# EAGLE design Teensylu (EAGLE 6.5.0)
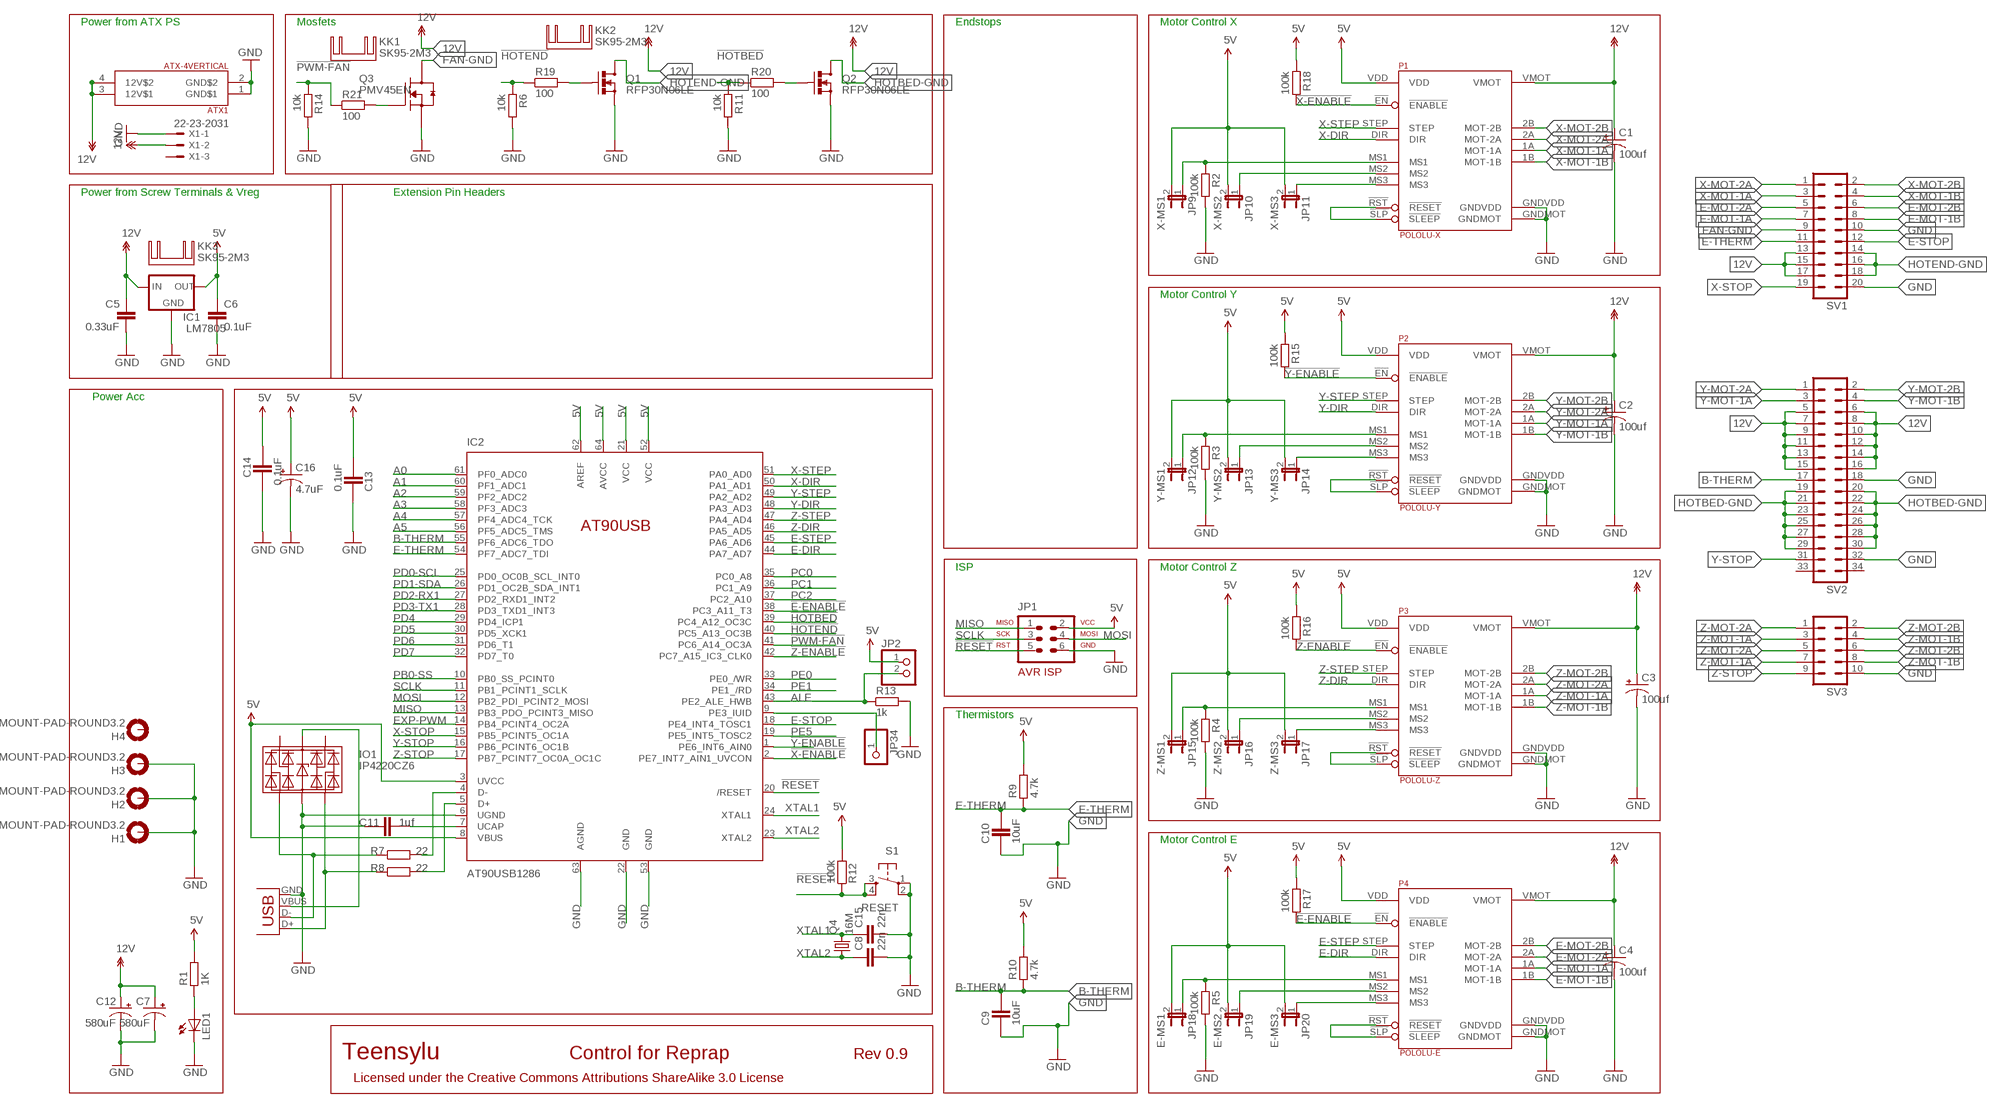
[diagram p0: schematic, sheet 1]

## Parts
ATX1  ATX-4VERTICAL  [MINIFITJR-4-VERTICAL]
C1  100uf  CAP_POLPTH1  [CPOL-RADIAL-100UF-25V]
C2  100uf  CAP_POLPTH1  [CPOL-RADIAL-100UF-25V]
C3  100uf  CAP_POLPTH1  [CPOL-RADIAL-100UF-25V]
C4  100uf  CAP_POLPTH1  [CPOL-RADIAL-100UF-25V]
C5  0.33uF  CAPPTH2  [CAP-PTH-SMALL2]
C6  0.1uF  CAPPTH2  [CAP-PTH-SMALL2]
C7  580uF  CAP_POLPTH4  [CPOL-RADIAL-1000UF-25V]
C8  22n  C-EUC0603  [C0603]
C9  10uF  CAPACITOR_0603  [CAPC1608X92N]
C10  10uF  CAPACITOR_0603  [CAPC1608X92N]
C11  1uf  CAPACITOR_0603  [CAPC1608X92N]
C12  580uF  CAP_POLPTH4  [CPOL-RADIAL-1000UF-25V]
C13  0.1uF  CAPACITOR_0603  [CAPC1608X92N]
C14  0.1uF  CAPACITOR_0603  [CAPC1608X92N]
C15  22n  C-EUC0603  [C0603]
C16  4.7uF  CAP_POLPTH2  [CPOL-RADIAL-10UF-25V]
H1  MOUNT-PAD-ROUND3.2  [3,2-PAD]
H2  MOUNT-PAD-ROUND3.2  [3,2-PAD]
H3  MOUNT-PAD-ROUND3.2  [3,2-PAD]
H4  MOUNT-PAD-ROUND3.2  [3,2-PAD]
IC1  LM7805  V_REG_78XX  [78XXL-CUSTOM]
IC2  AT90USB1286  AT90USB  [TQFP64-2]
IO1  IP4220CZ6  [SOT23-6]
J1  USB  USBPTH  [USB-B-PTH]
JP1  AVR-ISP-6VERT  [AVR-ISP-6]
JP2  PINHD-1X2  [1X02]
JP9  X-MS1  JUMPER-2PTH  [1X02]
JP10  X-MS2  JUMPER-2PTH  [1X02]
JP11  X-MS3  JUMPER-2PTH  [1X02]
JP12  Y-MS1  JUMPER-2PTH  [1X02]
JP13  Y-MS2  JUMPER-2PTH  [1X02]
JP14  Y-MS3  JUMPER-2PTH  [1X02]
JP15  Z-MS1  JUMPER-2PTH  [1X02]
JP16  Z-MS2  JUMPER-2PTH  [1X02]
JP17  Z-MS3  JUMPER-2PTH  [1X02]
JP18  E-MS1  JUMPER-2PTH  [1X02]
JP19  E-MS2  JUMPER-2PTH  [1X02]
JP20  E-MS3  JUMPER-2PTH  [1X02]
JP34  PINHD-1X1  [1X01]
KK1  SK95-2M3  [SK95-2M3]
KK2  SK95-2M3  [SK95-2M3]
KK3  SK95-2M3  [SK95-2M3]
LED1  LED5MM  [LED5MM]
P1  POLOLU-X  POLOLU-ALLEGRO  [POLOLU-ALLEGRO-PTH]
P2  POLOLU-Y  POLOLU-ALLEGRO  [POLOLU-ALLEGRO-PTH]
P3  POLOLU-Z  POLOLU-ALLEGRO  [POLOLU-ALLEGRO-PTH]
P4  POLOLU-E  POLOLU-ALLEGRO  [POLOLU-ALLEGRO-PTH]
Q1  RFP30N06LE  MOSFET-NCHANNELPTH2  [TO220V]
Q2  RFP30N06LE  MOSFET-NCHANNELPTH2  [TO220V]
Q3  PMV45EN  MOSFET-NCH_SOT-23  [SOT95P280X135-3N]
Q4  16M  CRYSTALHC49U-V  [HC49U-V]
R1  1K  RESISTOR_0603  [RESC1608X55N]
R2  100k  RESISTOR_0603  [RESC1608X55N]
R3  100k  RESISTOR_0603  [RESC1608X55N]
R4  100k  RESISTOR_0603  [RESC1608X55N]
R5  100k  RESISTOR_0603  [RESC1608X55N]
R6  10k  RESISTOR_0603  [RESC1608X55N]
R7  22  RESISTOR_0603  [RESC1608X55N]
R8  22  RESISTOR_0603  [RESC1608X55N]
R9  4.7k  RESISTOR_0603  [RESC1608X55N]
R10  4.7k  RESISTOR_0603  [RESC1608X55N]
R11  10k  RESISTOR_0603  [RESC1608X55N]
R12  100k  RESISTOR_0603  [RESC1608X55N]
R13  1k  RESISTOR_0603  [RESC1608X55N]
R14  10k  RESISTOR_0603  [RESC1608X55N]
R15  100k  RESISTOR_0603  [RESC1608X55N]
R16  100k  RESISTOR_0603  [RESC1608X55N]
R17  100k  RESISTOR_0603  [RESC1608X55N]
R18  100k  RESISTOR_0603  [RESC1608X55N]
R19  100  RESISTOR_0603  [RESC1608X55N]
R20  100  RESISTOR_0603  [RESC1608X55N]
R21  100  RESISTOR_0603  [RESC1608X55N]
S1  RESET  TAC_SWITCHPTH  [TACTILE-PTH]
SV1  ML20L  [ML20L]
SV2  ML34L  [ML34L]
SV3  ML10L  [ML10L]
X1  22-23-2031  [22-23-2031]

## Nets
5V: C6.1 C13.2 C14.1 C16.1(+) IC1.OUT IC2.3(UVCC) IC2.8(VBUS) IC2.21(VCC) IC2.52(VCC) IC2.62(AREF) IC2.64(AVCC) JP1.2 JP2.1 JP9.2 JP10.2 JP11.2 JP12.2 JP13.2 JP14.2 JP15.2 JP16.2 JP17.2 JP18.2 JP19.2 JP20.2 P1.VDD P2.VDD P3.VDD P4.VDD R1.2 R9.2 R10.2 R12.2 R15.1 R16.1 R17.1 R18.1
12V: ATX1.3(12V$1) ATX1.4(12V$2) C1.1(+) C2.1(+) C3.1(+) C4.1(+) C5.1 C7.1(+) C12.1(+) IC1.IN P1.VMOT P2.VMOT P3.VMOT P4.VMOT SV1.13 SV1.15 SV1.17 SV2.5 SV2.6 SV2.7 SV2.8 SV2.9 SV2.10 SV2.11 SV2.12 SV2.13 SV2.14 SV2.15 SV2.16 X1.2
!E-ENABLE: IC2.38(PC3_A11_T3) P4.!EN(!ENABLE) R17.2
!HOTBED: IC2.39(PC4_A12_OC3C) R11.1 R20.1
!HOTEND: IC2.40(PC5_A13_OC3B) R6.1 R19.1
!PWM-FAN: IC2.41(PC6_A14_OC3A) R14.1 R21.1
!RESET: IC2.20(/RESET) JP1.5 R12.1 S1.3 S1.4
!X-ENABLE: IC2.2(PE7_INT7_AIN1_UVCON) P1.!EN(!ENABLE) R18.2
!Y-ENABLE: IC2.1(PE6_INT6_AIN0) P2.!EN(!ENABLE) R15.2
!Z-ENABLE: IC2.42(PC7_A15_IC3_CLK0) P3.!EN(!ENABLE) R16.2
A0: IC2.61(PF0_ADC0)
A1: IC2.60(PF1_ADC1)
A2: IC2.59(PF2_ADC2)
A3: IC2.58(PF3_ADC3)
A4: IC2.57(PF4_ADC4_TCK)
A5: IC2.56(PF5_ADC5_TMS)
ALE: IC2.43(PE2_ALE_HWB) JP2.2 R13.1
B-THERM: C9.2 IC2.55(PF6_ADC6_TDO) R10.1 SV2.17
E-DIR: IC2.44(PA7_AD7) P4.DIR
E-MOT-1A [power]: P4.1A(MOT-1A) SV1.7
E-MOT-1B [power]: P4.1B(MOT-1B) SV1.8
E-MOT-2A [power]: P4.2A(MOT-2A) SV1.5
E-MOT-2B [power]: P4.2B(MOT-2B) SV1.6
E-MS1: JP18.1 P4.MS1 R5.1
E-MS2: JP19.1 P4.MS2
E-MS3: JP20.1 P4.MS3
E-RESETSLEEP: P4.!RST(!RESET) P4.!SLP(!SLEEP)
E-STEP: IC2.45(PA6_AD6) P4.STEP
E-STOP: IC2.18(PE4_INT4_TOSC1) SV1.12
E-THERM: C10.2 IC2.54(PF7_ADC7_TDI) R9.1 SV1.11
EXP-PWM: IC2.14(PB4_PCINT4_OC2A)
FAN-GND: Q3.3(D) SV1.9
GND [power]: ATX1.1(GND$1) ATX1.2(GND$2) C1.2(-) C2.2(-) C3.2(-) C4.2(-) C5.2 C6.2 C7.2(-) C8.2 C9.1 C10.1 C11.1 C12.2(-) C13.1 C14.2 C15.2 C16.2(-) H1.B3,2(MOUNT) H2.B3,2(MOUNT) H3.B3,2(MOUNT) IC1.GND IC2.6(UGND) IC2.22(GND) IC2.53(GND) IC2.63(AGND) IO1.2(GND) J1.GND JP1.6 LED1.K(C) P1.GNDMOT P1.GNDVDD P2.GNDMOT P2.GNDVDD P3.GNDMOT P3.GNDVDD P4.GNDMOT P4.GNDVDD Q1.3(S) Q2.3(S) Q3.2(S) R2.2 R3.2 R4.2 R5.2 R6.2 R11.2 R13.2 R14.2 S1.1 S1.2 SV1.10 SV1.20 SV2.18 SV2.32 SV3.10 X1.1
HOTBED-GND [power]: Q2.2(D) SV2.19 SV2.20 SV2.21 SV2.22 SV2.23 SV2.24 SV2.25 SV2.26 SV2.27 SV2.28 SV2.29 SV2.30
HOTEND-GND [power]: Q1.2(D) SV1.14 SV1.16 SV1.18
MISO: IC2.13(PB3_PDO_PCINT3_MISO) JP1.1
MOSI: IC2.12(PB2_PDI_PCINT2_MOSI) JP1.4
N$1: LED1.A R1.1
N$2: IO1.4(C) J1.D- R7.1
N$3: IC2.4(D-) R7.2
N$4: IC2.5(D+) R8.2
N$5: IO1.6(D) J1.D+ R8.1
N$6: IO1.5(UCC) J1.VBUS
N$7: IC2.9(PE3_IUID) JP34.1
N$9: C11.2 IC2.7(UCAP)
N$10: Q3.1(G) R21.2
N$11: Q1.1(G) R19.2
N$12: Q2.1(G) R20.2
PB0-SS: IC2.10(PB0_SS_PCINT0)
PC0: IC2.35(PC0_A8)
PC1: IC2.36(PC1_A9)
PC2: IC2.37(PC2_A10)
PD0-SCL: IC2.25(PD0_OC0B_SCL_INT0)
PD1-SDA: IC2.26(PD1_OC2B_SDA_INT1)
PD2-RX1: IC2.27(PD2_RXD1_INT2)
PD3-TX1: IC2.28(PD3_TXD1_INT3)
PD4: IC2.29(PD4_ICP1)
PD5: IC2.30(PD5_XCK1)
PD6: IC2.31(PD6_T1)
PD7: IC2.32(PD7_T0)
PE0: IC2.33(PE0_/WR)
PE1: IC2.34(PE1_/RD)
PE5: IC2.19(PE5_INT5_TOSC2)
SCLK: IC2.11(PB1_PCINT1_SCLK) JP1.3
X-DIR: IC2.50(PA1_AD1) P1.DIR
X-MOT-1A [power]: P1.1A(MOT-1A) SV1.3
X-MOT-1B [power]: P1.1B(MOT-1B) SV1.4
X-MOT-2A [power]: P1.2A(MOT-2A) SV1.1
X-MOT-2B [power]: P1.2B(MOT-2B) SV1.2
X-MS1: JP9.1 P1.MS1 R2.1
X-MS2: JP10.1 P1.MS2
X-MS3: JP11.1 P1.MS3
X-RESETSLEEP: P1.!RST(!RESET) P1.!SLP(!SLEEP)
X-STEP: IC2.51(PA0_AD0) P1.STEP
X-STOP: IC2.15(PB5_PCINT5_OC1A) SV1.19
XTAL1: C15.1 IC2.24(XTAL1) Q4.2
XTAL2: C8.1 IC2.23(XTAL2) Q4.1
Y-DIR: IC2.48(PA3_AD3) P2.DIR
Y-MOT-1A [power]: P2.1A(MOT-1A) SV2.3
Y-MOT-1B [power]: P2.1B(MOT-1B) SV2.4
Y-MOT-2A [power]: P2.2A(MOT-2A) SV2.1
Y-MOT-2B [power]: P2.2B(MOT-2B) SV2.2
Y-MS1: JP12.1 P2.MS1 R3.1
Y-MS2: JP13.1 P2.MS2
Y-MS3: JP14.1 P2.MS3
Y-RESETSLEEP: P2.!RST(!RESET) P2.!SLP(!SLEEP)
Y-STEP: IC2.49(PA2_AD2) P2.STEP
Y-STOP: IC2.16(PB6_PCINT6_OC1B) SV2.31
Z-DIR: IC2.46(PA5_AD5) P3.DIR
Z-MOT-1A [power]: P3.1A(MOT-1A) SV3.3 SV3.7
Z-MOT-1B [power]: P3.1B(MOT-1B) SV3.4 SV3.8
Z-MOT-2A [power]: P3.2A(MOT-2A) SV3.1 SV3.5
Z-MOT-2B [power]: P3.2B(MOT-2B) SV3.2 SV3.6
Z-MS1: JP15.1 P3.MS1 R4.1
Z-MS2: JP16.1 P3.MS2
Z-MS3: JP17.1 P3.MS3
Z-RESETSLEEP: P3.!RST(!RESET) P3.!SLP(!SLEEP)
Z-STEP: IC2.47(PA4_AD4) P3.STEP
Z-STOP: IC2.17(PB7_PCINT7_OC0A_OC1C) SV3.9
Unconnected: H4.B3,2(MOUNT) IO1.1(A) IO1.3(B) SV2.33 SV2.34 X1.3

## Notes on the sheet
- Power from ATX PS | Mosfets | Endstops | Motor Control X
- Power from Screw Terminals & Vreg | Extension Pin Headers
- Motor Control Y
- Power Acc
- ISP | Motor Control Z
- Thermistors
- Motor Control E
- Teensylu | Control for Reprap | Rev 0.9
- Licensed under the Creative Commons Attributions ShareAlike 3.0 License

## Library data of the parts
ATX1 = atx-power-supply:ATX-4
C1-C4 C7 C12 C16 = SparkFun:CAP_POL: Capacitor Polarized These are standard SMD and PTH capacitors. Normally 10uF, 47uF, and 100uF in electrolytic and tantalum varieties. Always verify the external diameter of the through hole cap, it varies with capacity, voltage, and manufacturer. The EIA devices should be standard.
C5 C6 = SparkFun:CAP: Capacitor Standard 0603 ceramic capacitor, and 0.1" leaded capacitor.
C8 C15 = resistor:C-EU: CAPACITOR, European symbol
C9-C11 C13 C14 = ipc-7351-capacitor:CAPACITOR_
H1-H4 = holes:MOUNT-PAD-ROUND: MOUNTING PAD, round
IC1 = SparkFun:V_REG_78XX: Voltage Regulator Standard 7805 5V regulator. IGO (Input Ground Output). Spark Fun Electronics SKU : COM-00107
IC2 = Atmel-at90usb-teensy:AT90USB
IO1 = protection:IP4220CZ6: IP4220CZ6 Dual USB 2.0 Integrated ESD protection to IEC 61000-4-2 level 4 FEATURES > ESD IEC 61000-4-2 level 4, ± 8kV contact discharge compliant protection > Four ultra-low input capacitance (1 pF typ.) ESD rail-to-rail protection diodes > Low voltage clamping due to integrated Zener diode > Small 6 lead SO6 (SOT457) package APPLICATIONS General-purpose downstream ESD protection high frequency analog signals and high-speed serial data transmission for ports inside: > Cellular and PCS mobile handsets > PC-/Notebook USB2.0/IEEE1394 ports > DVI interfaces > Cordless telephones > Wireless data (WAN/LAN) systems > PDAs; MPN: IP4220CZ6; OC_FARNELL: 1506629; PACKAGE: SOT-457; SUPPLIER: NXP
J1 = SparkFun:USB: USB Connectors USB-B-PTH is fully proven SKU : PRT-00139 USB-miniB is fully proven SKU : PRT-00587 USB-A-PCB is untested. USB-A-H is throughly reviewed, but untested. Spark Fun Electronics SKU : PRT-00437 USB-B-SMT is throughly reviewed, but untested. Needs silkscreen touching up. USB-A-S has not been used/tested USB-MB-H has not been used/tested
JP1 = avr-7:AVR-ISP-6: AVR ISP-6 Serial Programming Header
JP2 = pinhead:PINHD-1X2: PIN HEADER
JP9-JP20 = SparkFun:JUMPER-2: Jumper Basic 0.1" spaced jumper. Use with breakaway headers.
JP34 = pinhead:PINHD-1X1: PIN HEADER
KK1-KK3 = heatsink:SK95-2M3: HEATSINK manufacturer Fischer/distributor Buerklin
LED1 = led:LED: LED OSRAM: - CHIPLED LG R971, LG N971, LY N971, LG Q971, LY Q971, LO R971, LY R971 LH N974, LH R974 LS Q976, LO Q976, LY Q976 LO Q996 - Hyper CHIPLED LW Q18S LB Q993, LB Q99A, LB R99A - SideLED LS A670, LO A670, LY A670, LG A670, LP A670 LB A673, LV A673, LT A673, LW A673 LH A674 LY A675 LS A676, LA A676, LO A676, LY A676, LW A676 LS A679, LY A679, LG A679 - Hyper Micro SIDELED® LS Y876, LA Y876, LO Y876, LY Y876 LT Y87S - SmartLED LW L88C, LW L88S LB L89C, LB L89S, LG L890 LS L89K, LO L89K, LY L89K LS L896, LA L896, LO L896, LY L896 - TOPLED LS T670, LO T670, LY T670, LG T670, LP T670 LSG T670, LSP T670, LSY T670, LOP T670, LYG T670 LG T671, LOG T671, LSG T671 LB T673, LV T673, LT T673, LW T673 LH T674 LS T676, LA T676, LO T676, LY T676, LB T676, LH T676, LSB T676, LW T676 LB T67C, LV T67C, LT T67C, LS T67K, LO T67K, LY T67K, LW E67C LS E67B, LA E67B, LO E67B, LY E67B, LB E67C, LV E67C, LT E67C LW T67C LS T679, LY T679, LG T679 LS T770, LO T770, LY T770, LG T770, LP T770 LB T773, LV T773, LT T773, LW T773 LH T774 LS E675, LA E675, LY E675, LS T675 LS T776, LA T776, LO T776, LY T776, LB T776 LHGB T686 LT T68C, LB T68C - Hyper Mini TOPLED® LB M676 - Mini TOPLED Santana® LG M470 LS M47K, LO M47K, LY M47K Source: http://www.osram.convergy.de LUXEON: - LUMILED® LXK2-PW12-R00, LXK2-PW12-S00, LXK2-PW14-U00, LXK2-PW14-V00 LXK2-PM12-R00, LXK2-PM12-S00, LXK2-PM14-U00 LXK2-PE12-Q00, LXK2-PE12-R00, LXK2-PE12-S00, LXK2-PE14-T00, LXK2-PE14-U00 LXK2-PB12-K00, LXK2-PB12-L00, LXK2-PB12-M00, LXK2-PB14-N00, LXK2-PB14-P00, LXK2-PB14-Q00 LXK2-PR12-L00, LXK2-PR12-M00, LXK2-PR14-Q00, LXK2-PR14-R00 LXK2-PD12-Q00, LXK2-PD12-R00, LXK2-PD12-S00 LXK2-PH12-R00, LXK2-PH12-S00 LXK2-PL12-P00, LXK2-PL12-Q00, LXK2-PL12-R00 Source: www.luxeon.com KINGBRIGHT: KA-3528ASYC Source: www.kingbright.com
P1-P4 = pololu-allegro:POLOLU-ALLEGRO
Q1 Q2 = SparkFun:MOSFET-NCHANNEL
Q3 = ipc-7351-transistor:MOSFET-NCH_
Q4 = crystal:CRYSTAL: CRYSTAL; OC_FARNELL: 1666969; OC_NEWARK: unknown
R1-R21 = ipc-7351-resistor:RESISTOR_
S1 = SparkFun:TAC_SWITCH: Momentary Switch Button commonly used for reset or general input. Spark Fun Electronics SKU : COM-00097
SV1 = con-harting-ml:ML20: HARTING; OC_FARNELL: unknown; OC_NEWARK: unknown
SV2 = con-harting-ml:ML34: HARTING; OC_FARNELL: unknown; OC_NEWARK: unknown
SV3 = con-harting-ml:ML10: HARTING; OC_FARNELL: unknown; OC_NEWARK: unknown
X1 = con-molex:22-23-2031: .100" (2.54mm) Center Header - 3 Pin; MF: MOLEX; MPN: 22-23-2031; OC_FARNELL: 1462950; OC_NEWARK: 30C0862

## Board
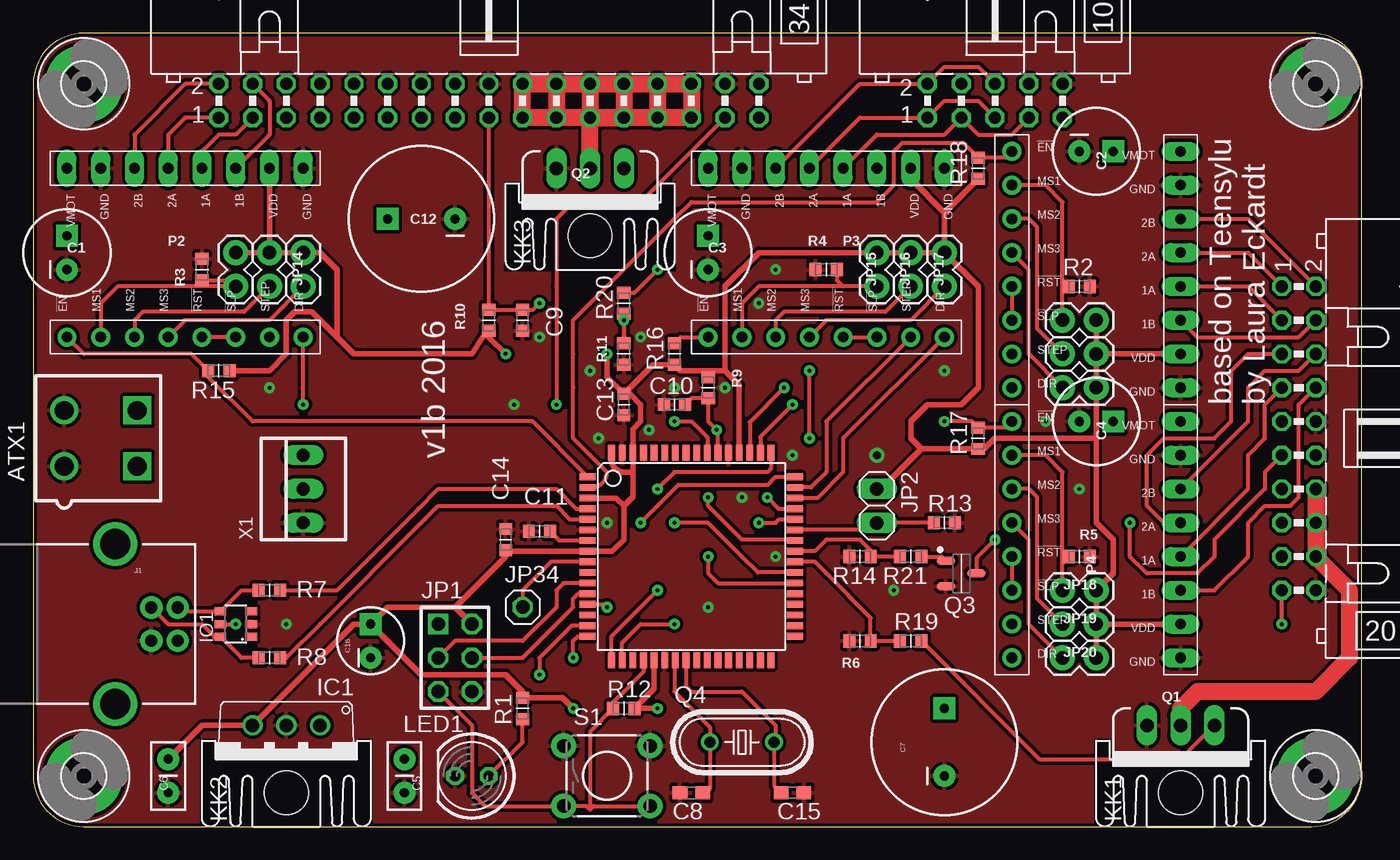
[diagram p1: board, top side]
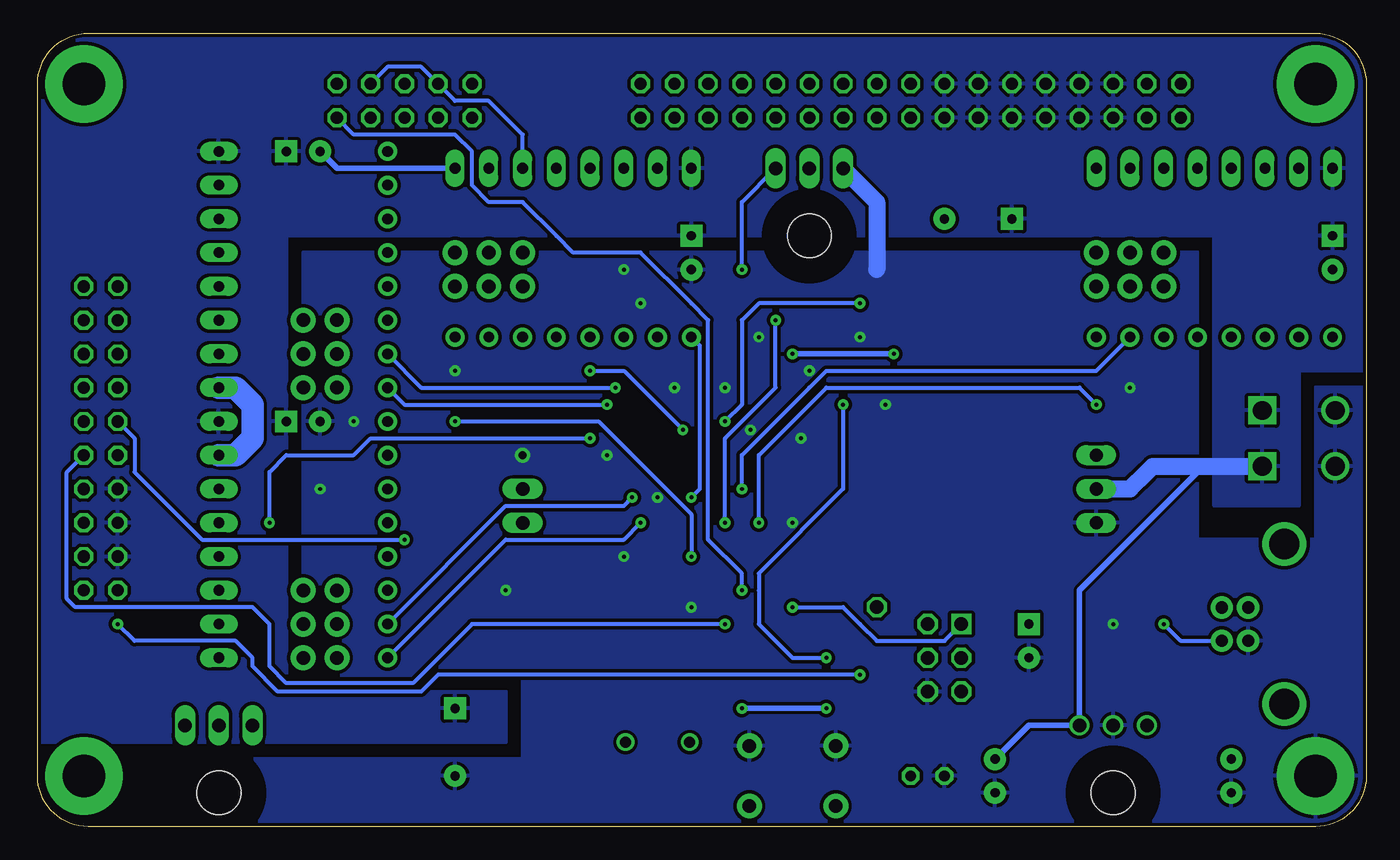
[diagram p2: board, bottom side, seen from below]

Size 100 x 59.69 mm. Coordinates in mm from the lower left corner, seen from the top.
Outline: 0,3.81 arc90 3.81,0 96.19,0 arc90 100,3.81 100,55.88 arc90 96.19,59.69 3.81,59.69 arc90 0,55.88 0,3.81
Copper layers (1*16): Top 0.035mm / dielectric 1.5mm / Bottom 0.035mm
Design rules "10width10space20drill10annular *": minimum track width 10mil, minimum drill 0.3mm, track to track 10mil, track to pad 10mil, pad to pad 10mil, via to via 10mil, smd to smd 0mil, copper to edge 10mil, drill to drill 10mil, minimum pad ring 10mil, minimum via ring 10mil, stop-mask expansion 2mil, vias tented up to drill 25mil, thermal gap 10mil

### Footprints (pad centres in the part's own frame; a part is rotated, then mirrored left to right if it is on the bottom)
MINIFITJR-4-VERTICAL = drill 1.4: 1 2.1,-2.75; 2 -2.1,-2.75 | drill 1.4 square: 3 2.1,2.75; 4 -2.1,2.75
CPOL-RADIAL-100UF-25V = drill 0.7 pad 1.651 square: 1 1.27,0 | drill 0.7 pad 1.651: 2 -1.27,0
CAP-PTH-SMALL2 = drill 0.7 pad 1.651: 1 0,0; 2 2.54,0
CPOL-RADIAL-1000UF-25V = drill 0.7 pad 1.651 square: 1 2.54,0 | drill 0.7 pad 1.651: 2 -2.54,0
C0603 = smd 1.1 x 1: 1 -0.85,0; 2 0.85,0
CAPC1608X92N = smd 0.9 x 0.95: 1 -0.8,0; 2 0.8,0
CPOL-RADIAL-10UF-25V = drill 0.7 pad 1.651 square: 1 1.27,0 | drill 0.7 pad 1.651: 2 -1.27,0
3,2-PAD = drill 3.2 pad 5.842: B3,2 0,0
78XXL-CUSTOM = drill 1.016: GND 0,0; IN -2.54,0; OUT 2.54,0
TQFP64-2 = smd 1.194 x 0.508: 1 -7.8,6; 2 -7.8,5.2; 3 -7.8,4.4; 4 -7.8,3.6; 5 -7.8,2.8; 6 -7.8,2; 7 -7.8,1.2; 8 -7.8,0.4; 9 -7.8,-0.4; 10 -7.8,-1.2; 11 -7.8,-2; 12 -7.8,-2.8; 13 -7.8,-3.6; 14 -7.8,-4.4; 15 -7.8,-5.2; 16 -7.8,-6; 33 7.8,-6; 34 7.8,-5.2; 35 7.8,-4.4; 36 7.8,-3.6; 37 7.8,-2.8; 38 7.8,-2; 39 7.8,-1.2; 40 7.8,-0.4; 41 7.8,0.4; 42 7.8,1.2; 43 7.8,2; 44 7.8,2.8; 45 7.8,3.6; 46 7.8,4.4; 47 7.8,5.2; 48 7.8,6 | smd 0.508 x 1.194: 17 -6,-7.8; 18 -5.2,-7.8; 19 -4.4,-7.8; 20 -3.6,-7.8; 21 -2.8,-7.8; 22 -2,-7.8; 23 -1.2,-7.8; 24 -0.4,-7.8; 25 0.4,-7.8; 26 1.2,-7.8; 27 2,-7.8; 28 2.8,-7.8; 29 3.6,-7.8; 30 4.4,-7.8; 31 5.2,-7.8; 32 6,-7.8; 49 6,7.8; 50 5.2,7.8; 51 4.4,7.8; 52 3.6,7.8; 53 2.8,7.8; 54 2,7.8; 55 1.2,7.8; 56 0.4,7.8; 57 -0.4,7.8; 58 -1.2,7.8; 59 -2,7.8; 60 -2.8,7.8; 61 -3.6,7.8; 62 -4.4,7.8; 63 -5.2,7.8; 64 -6,7.8
SOT23-6 = smd 0.6 x 0.9: 1 -0.95,-1.15; 2 0,-1.15; 3 0.95,-1.15; 4 0.95,1.15; 5 0,1.15; 6 -0.95,1.15
USB-B-PTH = drill 0.914 pad 1.676: D+ 0,1.25; D- 1.981,1.25; GND 0,-1.25; VBUS 1.981,-1.25 | drill 2.286: P$1 -2.718,-6.02; P$2 -2.718,6.02
AVR-ISP-6 = drill 1.016 square: 1 -2.54,-1.27 | drill 1.016 octagon: 2 -2.54,1.27; 3 0,-1.27; 4 0,1.27; 5 2.54,-1.27; 6 2.54,1.27
1X02 = drill 1.016 long: 1 -1.27,0; 2 1.27,0
1X02' = drill 1.016 pad 1.88: 1 0,0; 2 2.54,0
1X01 = drill 1.016 octagon: 1 0,0
SK95-2M3 = hole 3.302: 0,2.54
LED5MM = drill 0.813 octagon: A -1.27,0; K 1.27,0
POLOLU-ALLEGRO-PTH = drill 0.8 pad 1.422 long: 1A 6.35,-1.27; 1B 6.35,-3.81; 2A 6.35,1.27; 2B 6.35,3.81; GNDMOT 6.35,6.35; GNDVDD 6.35,-8.89; VDD 6.35,-6.35; VMOT 6.35,8.89 | drill 0.8 pad 1.422: !EN -6.35,8.89; !RST -6.35,-1.27; !SLP -6.35,-3.81; DIR -6.35,-8.89; MS1 -6.35,6.35; MS2 -6.35,3.81; MS3 -6.35,1.27; STEP -6.35,-6.35
TO220V = drill 1.016 long: 1 -2.54,0; 2 0,0; 3 2.54,0
SOT95P280X135-3N = smd 1.4 x 0.65: 1 -1.15,0.95; 2 -1.15,-0.95; 3 1.15,0
HC49U-V = drill 0.813: 1 -2.413,0; 2 2.413,0
RESC1608X55N = smd 0.9 x 1: 1 -0.8,0; 2 0.8,0
TACTILE-PTH = drill 1.016 pad 1.88: 1 -3.251,2.261; 2 3.251,2.261; 3 -3.251,-2.261; 4 3.251,-2.261
ML20L = drill 0.914 octagon: 1 -11.43,-1.27; 2 -11.43,1.27; 3 -8.89,-1.27; 4 -8.89,1.27; 5 -6.35,-1.27; 6 -6.35,1.27; 7 -3.81,-1.27; 8 -3.81,1.27; 9 -1.27,-1.27; 10 -1.27,1.27; 11 1.27,-1.27; 12 1.27,1.27; 13 3.81,-1.27; 14 3.81,1.27; 15 6.35,-1.27; 16 6.35,1.27; 17 8.89,-1.27; 18 8.89,1.27; 19 11.43,-1.27; 20 11.43,1.27
ML34L = drill 0.914 octagon: 1 -20.32,-1.27; 2 -20.32,1.27; 3 -17.78,-1.27; 4 -17.78,1.27; 5 -15.24,-1.27; 6 -15.24,1.27; 7 -12.7,-1.27; 8 -12.7,1.27; 9 -10.16,-1.27; 10 -10.16,1.27; 11 -7.62,-1.27; 12 -7.62,1.27; 13 -5.08,-1.27; 14 -5.08,1.27; 15 -2.54,-1.27; 16 -2.54,1.27; 17 0,-1.27; 18 0,1.27; 19 2.54,-1.27; 20 2.54,1.27; 21 5.08,-1.27; 22 5.08,1.27; 23 7.62,-1.27; 24 7.62,1.27; 25 10.16,-1.27; 26 10.16,1.27; 27 12.7,-1.27; 28 12.7,1.27; 29 15.24,-1.27; 30 15.24,1.27; 31 17.78,-1.27; 32 17.78,1.27; 33 20.32,-1.27; 34 20.32,1.27
ML10L = drill 0.914 octagon: 1 -5.08,-1.27; 2 -5.08,1.27; 3 -2.54,-1.27; 4 -2.54,1.27; 5 0,-1.27; 6 0,1.27; 7 2.54,-1.27; 8 2.54,1.27; 9 5.08,-1.27; 10 5.08,1.27
22-23-2031 = drill 1 long: 1 -2.54,0; 2 0,0; 3 2.54,0

### Placement (x,y rotation side)
ATX1  5.08,29.21 270 top
C1  2.54,43.18 90 top
C2  80.01,50.8 0 top
C3  50.8,43.18 90 top
C4  80.01,30.48 0 top
C5  27.94,5.08 270 top
C6  10.16,5.08 270 top
C7  68.58,6.35 90 top
C8  49.53,2.54 180 top
C9  36.83,38.1 90 top
C10  48.26,31.75 0 top
C11  38.1,22.23 0 top
C12  29.21,45.72 180 top
C13  44.45,31.75 90 top
C14  35.56,21.59 90 top
C15  57.15,2.54 0 top
C16  25.4,13.97 90 top
H1  3.81,3.81 0 top
H2  3.81,55.88 0 top
H3  96.52,55.88 0 top
H4  96.52,3.81 0 top
IC1  19.05,7.62 180 top
IC2  49.53,20.32 0 top
IO1  15.24,15.24 90 top
J1  8.89,15.24 0 top
JP1  31.75,12.7 270 top
JP2  63.5,24.13 270 top
JP9  X-MS1  [1X02']  77.47,38.1 0 top
JP10  X-MS2  [1X02']  77.47,35.56 0 top
JP11  X-MS3  [1X02']  77.47,33.02 0 top
JP12  Y-MS1  [1X02']  15.24,40.64 90 top
JP13  Y-MS2  [1X02']  17.78,40.64 90 top
JP14  Y-MS3  [1X02']  20.32,40.64 90 top
JP15  Z-MS1  [1X02']  63.5,40.64 90 top
JP16  Z-MS2  [1X02']  66.04,40.64 90 top
JP17  Z-MS3  [1X02']  68.58,40.64 90 top
JP18  E-MS1  [1X02']  77.47,17.78 0 top
JP19  E-MS2  [1X02']  77.47,15.24 0 top
JP20  E-MS3  [1X02']  77.47,12.7 0 top
JP34  36.83,16.51 0 top
KK1  86.36,5.08 180 top
KK2  19.05,5.08 180 top
KK3  41.91,46.99 180 top
LED1  33.02,3.81 180 top
P1  80.01,41.91 0 top
P2  11.43,43.18 90 top
P3  59.69,43.18 90 top
P4  80.01,21.59 0 top
Q1  86.36,7.62 180 top
Q2  41.91,49.53 180 top
Q3  69.85,19.05 0 top
Q4  53.34,6.35 0 top
R1  36.83,8.89 90 top
R2  78.74,40.64 0 top
R3  12.7,41.91 90 top
R4  59.69,41.91 180 top
R5  78.74,20.32 0 top
R6  62.23,13.97 180 top
R7  17.78,17.78 0 top
R8  17.78,12.7 0 top
R9  50.8,33.02 90 top
R10  34.29,38.1 270 top
R11  44.45,35.56 270 top
R12  44.45,8.89 0 top
R13  68.58,22.86 0 top
R14  62.23,20.32 180 top
R15  13.97,34.29 180 top
R16  48.26,35.56 90 top
R17  71.12,29.21 90 top
R18  71.12,49.53 90 top
R19  66.04,13.97 0 top
R20  44.45,39.37 90 top
R21  66.04,20.32 0 top
S1  43.18,3.81 0 top
SV1  95.25,29.21 270 top
SV2  34.29,54.61 0 top
SV3  72.39,54.61 0 top
X1  20.32,25.4 90 top

### Tracks (layer width: path | path; a pad name or v marks a point on that pad's centre or on a via)
5V  (via drill 0.3)
  Top 0.305: IC2.52 53.13,33.23 52.07,34.29
  Top 0.406: JP1.2 31.75,16.51 | 31.75,16.51 26.67,16.51 C16.1 | C16.1 24.13,15.24 IC1.OUT 12.7,7.62 C6.1 | IC2.21 46.73,10.37 R12.2 v46.99,8.89 | 44.45,24.13 44.45,21.59 43.58,20.72 IC2.8 35.63,20.72 C14.1 35.56,20.32 31.75,16.51 | 44.45,24.13 43.86,24.72 IC2.3 | 45.13,26.67 IC2.62 45.13,29.89 45.72,30.48 45.72,31.75 44.92,32.55 C13.2 | 45.13,26.67 45.13,26.04 45.13,24.81 44.45,24.13 | C13.2 46.66,34.76 R16.1 48.73,34.29 50.8,34.29 | JP20.2 JP19.2 | JP10.2 JP11.2 80.01,30.48 80.01,29.21 | JP13.2 JP14.2 21.59,43.18 22.86,41.91 22.86,36.83 | JP13.2 JP12.2 | v35.56,35.56 34.29,36.83 R10.2 33.82,36.83 33.02,35.56 24.13,35.56 22.86,36.83 | v43.18,35.56 43.18,33.82 C13.2 | JP17.2 JP16.2 JP15.2 54.61,43.18 52.07,40.64 52.07,34.29 | v40.64,8.89 39.84,9.69 R1.2 36.83,10.16 35.56,11.43 29.21,11.43 C16.1 | R15.1 17.78,34.29 19.05,35.56 19.05,38.1 19.68,38.73 20.95,38.73 22.86,36.83 | JP13.2 P2.VDD | JP19.2 P4.VDD | JP19.2 JP18.2 81.28,19.05 81.28,20.32 81.28,21.59 80.01,22.86 80.01,29.21 | JP10.2 JP9.2 | JP10.2 P1.VDD | 80.01,29.21 72.39,29.21 71.59,28.41 R17.1 66.84,28.41 | R18.1 68.58,46.19 | 68.58,46.19 JP17.2 | 68.58,46.19 66.04,48.73 P3.VDD | JP17.2 71.12,40.64 71.12,33.02 69.85,31.75 67.31,31.75 66.04,30.48 66.04,29.21 66.84,28.41 | 66.84,28.41 63.83,25.4 JP2.1 | 52.07,34.29 50.8,34.29 | IC2.52 53.13,33.23 52.07,34.29 | IC2.64 43.53,27.59 arc90 44.45,26.67 45.13,26.67 | R9.2 50.8,34.29
  Bottom 0.406: v35.56,35.56 v43.18,35.56 | v40.64,8.89 v46.99,8.89
12V
  Bottom 0.406: ATX1.3 12.26,27.11 21.59,17.78 IC1.IN 25.4,7.62 C5.1
  Bottom 1.27: X1.2 17.78,25.4 16.51,26.67 16.07,27.11 ATX1.3
  pour Bottom: 5.08,24.13 11.43,24.13 11.43,44.45 81.28,44.45 81.28,10.16 64.77,10.16 64.77,6.35 100.33,6.35 100.33,59.69 0,59.69 0,34.29 5.08,34.29
!E-ENABLE  (via drill 0.3)
  Top 0.305: P4.!EN 73.19,30.01 R17.2 70.65,30.48 v68.58,30.48 | v50.8,20.32 50.8,19.05 51.53,18.32 IC2.38
  Bottom 0.305: v68.58,30.48 57.78,30.48 50.8,23.5 v50.8,20.32
!HOTBED  (via drill 0.3)
  Top 0.305: IC2.39 54.54,19.12 53.34,20.32 50.8,22.86 v48.26,22.86 | v44.45,38.1 R11.1 R20.1
  Bottom 0.305: v48.26,22.86 48.26,29.21 44.45,33.02 v44.45,38.1
!HOTEND
  Top 0.305: R19.1 R6.1 63.03,15.71 59.69,19.05 58.82,19.92 IC2.40
!PWM-FAN
  Top 0.305: R21.1 R14.1 63.03,20.79 62.23,21.59 59.69,21.59 58.82,20.72 IC2.41
!RESET
  Top 0.305: IC2.20 45.93,11.64 44.45,10.16 43.65,9.36 R12.1 41.91,7.15 41.91,2.54 41.91,1.27 | 41.91,1.27 41.63,1.55 S1.3 34.01,1.55 33.02,2.54 33.02,7.62 JP1.5 | 41.91,1.27 42.19,1.55 S1.4
!X-ENABLE
  Top 0.305: P1.!EN 73.19,50.33 R18.2 70.02,51.44 65.41,51.44 64.77,50.8 64.77,48.26 63.5,46.99 49.53,46.99 48.26,45.72 46.99,44.45 41.91,39.37 40.64,38.1 40.64,35.56 40.64,33.02 40.64,29.21 41.27,28.57 41.91,27.94 43.18,26.67 arc-90 42.03,25.52 IC2.2
!Y-ENABLE
  Top 0.305: IC2.1 37.57,30.48 16.51,30.48 13.17,33.82 R15.2 11.9,35.56 3.81,35.56 P2.!EN
!Z-ENABLE  (via drill 0.3)
  Top 0.305: IC2.42 57.26,21.59 53.34,21.59 50.8,24.13 v50.8,24.77 | R16.2 48.73,36.83 P3.!EN
  Bottom 0.305: v50.8,24.77 50.16,25.4 50.16,36.2 P3.!EN
ALE
  Top 0.305: IC2.43 62.96,22.32 JP2.2 R13.1
B-THERM  (via drill 0.3)
  Top 0.305: SV2.17 R10.1 C9.2 37.63,38.9 v38.1,39.37 | v48.26,30.48 49.53,30.48 50.73,29.28 IC2.55
  Bottom 0.305: v38.1,39.37 45.72,39.37 46.99,38.1 46.99,31.75 v48.26,30.48
E-DIR  (via drill 0.3)
  Top 0.305: v54.61,22.86 55.88,22.86 56.14,23.12 IC2.44
  Bottom 0.305: P4.DIR 64.77,21.59 55.88,21.59 v54.61,22.86
E-MOT-1A
  Top 0.305: P4.1A 91.44,25.4 91.44,27.94 92.71,29.21 92.71,31.75 SV1.7
E-MOT-1B
  Top 0.305: P4.1B 88.9,17.78 91.44,20.32 91.44,22.86 92.71,24.13 94.61,24.13 95.25,24.77 95.25,25.4 95.25,31.75 SV1.8
E-MOT-2A
  Top 0.305: P4.2A 85.09,22.86 83.82,24.13 83.82,27.94 85.09,29.21 88.9,29.21 90.17,30.48 90.17,34.29 91.44,35.56 SV1.5
E-MOT-2B
  Top 0.305: P4.2B 91.44,30.48 91.44,33.02 92.71,34.29 95.25,34.29 SV1.6
E-MS1
  Top 0.305: R5.1 77.47,19.85 JP18.1 77.47,26.67 76.2,27.94 P4.MS1
E-MS2
  Top 0.305: JP19.1 75.56,17.14 75.56,24.77 74.93,25.4 P4.MS2
E-MS3
  Top 0.305: JP20.1 74.93,15.24 74.93,21.59 P4.MS3
E-RESETSLEEP
  Top 0.305: P4.!RST P4.!SLP
E-STEP  (via drill 0.3)
  Top 0.305: v55.24,24.77 56.09,23.92 IC2.45
  Bottom 0.305: P4.STEP 64.77,24.13 55.88,24.13 v55.24,24.77
E-STOP  (via drill 0.3)
  Top 0.305: IC2.18 44.33,13.85 44.45,13.97 45.72,15.24 v48.26,15.24
  Bottom 0.305: v48.26,15.24 67.31,15.24 71.75,10.79 81.28,10.79 82.55,12.06 82.55,15.24 83.82,16.51 97.16,16.51 97.79,17.14 97.79,26.67 SV1.12
E-THERM  (via drill 0.3)
  Top 0.305: SV1.11 92.71,26.67 92.71,25.4 88.9,21.59 88.9,20.32 87.63,19.05 83.82,19.05 82.55,20.32 v82.55,22.86 | v58.42,29.21 58.42,31.11 | 58.42,31.11 v58.42,34.29 58.42,31.11 | IC2.54 51.53,29.94 v51.44,29.84 50.8,30.48 R9.1 49.53,32.22 C10.2
  Bottom 0.305: v82.55,22.86 82.55,26.67 81.28,27.94 76.2,27.94 74.93,29.21 v58.42,29.21 | v58.42,34.29 55.88,34.29 v51.44,29.84
FAN-GND  (via drill 0.3)
  Top 0.305: v72.39,21.59 71,20.2 Q3.3
  Bottom 0.305: SV1.9 92.71,29.21 92.71,26.67 87.63,21.59 v72.39,21.59
GND  (via drill 0.3, 0.6)
  Bottom 0.406: P3.GNDVDD 77.47,49.53 C2.2
  Bottom 1.27: Q2.3 36.83,46.99 36.83,41.91
  Bottom 1.676: P4.GNDMOT 85.09,27.94 83.82,29.21 83.82,31.75 85.09,33.02 P1.GNDVDD
  other vias: 43.18,22.86 42.55,29.21 48.26,33.02 50.8,16.51 64.77,17.78 63.5,27.94 68.58,34.29 57.15,27.94 53.34,24.77 55.88,20.32 17.78,33.02 76.2,30.48 78.74,25.4 55.88,41.91 54.61,39.37 45.72,36.83 38.1,36.83 36.2,31.75 52.07,33.02 46.35,29.84 41.91,34.29 19.05,15.24
  pour Top: -1.27,-1.27 101.6,-1.27 101.6,60.96 -1.27,60.96
  pour Bottom: -2.54,-1.27 -2.54,33.02 3.81,33.02 3.81,21.59 12.7,21.59 12.7,43.18 80.01,43.18 80.01,11.43 63.5,11.43 63.5,5.08 100.33,5.08 100.33,-1.27
HOTBED-GND
  Top 0.305: SV2.30 SV2.29 | SV2.19 SV2.20
  Top 1.27: Q2.2 SV2.23 | SV2.23 SV2.21 SV2.22 SV2.20 | SV2.23 SV2.19 SV2.20 | SV2.20 SV2.24 | SV2.24 SV2.26 | SV2.26 SV2.28 | SV2.28 SV2.30 SV2.29 SV2.27 | SV2.27 SV2.25 | SV2.25 SV2.23 | SV2.23 SV2.25 | SV2.26 SV2.25 | SV2.24 SV2.23 | SV2.28 SV2.27
HOTEND-GND
  Top 1.27: SV1.14 SV1.16 SV1.18 99.06,17.78 99.06,12.7 96.52,10.16 87.63,10.16 86.36,8.89 Q1.2
MISO  (via drill 0.3)
  Top 0.305: IC2.13 42.97,16.72 v43.18,16.51
  Bottom 0.305: v43.18,16.51 39.37,16.51 38.1,15.24 36.83,13.97 31.75,13.97 JP1.1
MOSI
  Top 0.305: JP1.4 36.83,12.7 40.64,16.51 40.64,17.14 41.02,17.52 IC2.12
N$1
  Top 0.305: LED1.A 36.83,6.35 R1.1
N$2
  Top 0.305: J1.D- 11.17,16.19 IO1.4 15.68,17.78 R7.1
N$3
  Top 0.305: R7.2 22.86,17.78 29,23.92 30.48,25.4 39.37,25.4 40.85,23.92 IC2.4
N$4
  Top 0.305: IC2.5 40.38,23.12 39.37,24.13 30.48,24.13 29.47,23.12 29.21,22.86 21.59,15.24 19.05,12.7 R8.2
N$5
  Top 0.305: 8.91,16.49 10.16,15.24 12.7,15.24 13.65,14.29 | R8.1 15.68,12.7 IO1.6
  Top 0.406: J1.D+ 8.91,16.49 | 13.65,14.29 IO1.6
N$6  (via drill 0.3)
  Top 0.305: IO1.5 v15.24,15.24
  Bottom 0.305: v15.24,15.24 13.99,13.99 J1.VBUS
N$7
  Top 0.305: IC2.9 38.97,19.92 36.83,17.78 JP34.1
N$9
  Top 0.305: IC2.7 39.6,21.52 C11.2
N$10
  Top 0.305: R21.2 68.38,20.32 Q3.1
N$11
  Top 0.305: R19.2 75.73,5.08 86.36,5.08 87.63,6.35 Q1.1
N$12  (via drill 0.3)
  Top 0.305: R20.2 45.25,40.17 v46.99,41.91
  Bottom 0.305: v46.99,41.91 46.99,46.99 Q2.1
SCLK
  Top 0.305: IC2.11 39.91,18.32 39.37,17.78 39.37,16.51 36.83,13.97 31.75,13.97 JP1.3
X-DIR  (via drill 0.3)
  Top 0.305: v57.15,31.75 54.73,29.33 IC2.50
  Bottom 0.305: P1.DIR 72.39,31.75 v57.15,31.75
X-MOT-1A
  Top 0.305: P1.1A 91.44,40.64 SV1.3
X-MOT-1B
  Top 0.305: P1.1B 87.63,36.83 95.25,36.83 SV1.4
X-MOT-2A
  Top 0.305: P1.2A 91.44,43.18 SV1.1
X-MOT-2B
  Top 0.305: P1.2B 91.44,45.72 SV1.2
X-MS1
  Top 0.305: R2.1 77.47,40.17 JP9.1 77.47,46.99 76.2,48.26 P1.MS1
X-MS2
  Top 0.305: JP10.1 75.56,37.47 75.56,45.09 74.93,45.72 P1.MS2
X-MS3
  Top 0.305: JP11.1 74.93,35.56 74.93,41.91 P1.MS3
X-RESETSLEEP
  Top 0.305: P1.!RST P1.!SLP
X-STEP  (via drill 0.3)
  Top 0.305: v56.52,33.02 53.93,30.43 IC2.51
  Bottom 0.305: P1.STEP 71.12,33.02 v56.52,33.02
X-STOP  (via drill 0.3)
  Top 0.305: IC2.15 40.52,15.12 38.1,12.7 v38.1,11.43 | v93.98,15.24 SV1.19
  Bottom 0.305: v38.1,11.43 69.85,11.43 71.12,10.16 81.92,10.16 83.82,12.06 83.82,12.7 85.09,13.97 92.71,13.97 v93.98,15.24
XTAL1
  Top 0.305: IC2.24 49.13,10.56 49.53,10.16 53.34,10.16 55.88,7.62 55.88,6.48 Q4.2 55.75,3.09 C15.1
XTAL2
  Top 0.305: IC2.23 48.26,12.45 48.26,10.16 50.93,7.49 Q4.1 50.93,2.83 C8.1
Y-DIR  (via drill 0.3)
  Top 0.305: v45.72,22.86 46.99,24.13 48.55,25.68 55.24,25.68 55.88,26.32 IC2.48 | v20.32,31.75 P2.DIR
  Bottom 0.305: v45.72,22.86 45.72,27.94 40.64,33.02 21.59,33.02 v20.32,31.75
Y-MOT-1A
  Top 0.305: SV2.3 15.24,52.07 13.97,52.07 12.7,50.8 P2.1A
Y-MOT-1B
  Top 0.305: SV2.4 17.78,54.61 17.78,52.07 P2.1B
Y-MOT-2A
  Top 0.305: SV2.1 11.43,53.34 10.16,52.07 P2.2A
Y-MOT-2B
  Top 0.305: SV2.2 11.43,55.88 7.62,52.07 P2.2B
Y-MS1
  Top 0.305: R3.1 14.77,41.11 JP12.1 6.35,40.64 5.08,39.37 P2.MS1
Y-MS2
  Top 0.305: JP13.1 15.88,38.73 8.26,38.73 7.62,38.1 P2.MS2
Y-MS3
  Top 0.305: JP14.1 17.78,38.1 11.43,38.1 P2.MS3
Y-RESETSLEEP
  Top 0.305: P2.!SLP P2.!RST
Y-STEP  (via drill 0.3)
  Top 0.305: IC2.49 55.53,26.95 55.24,26.67 48.26,26.67 v46.99,25.4
  Bottom 0.305: v46.99,25.4 46.99,27.94 41.91,33.02 40.64,34.29 20.32,34.29 P2.STEP
Y-STOP  (via drill 0.3)
  Top 0.305: SV2.31 45.72,46.99 40.64,46.99 39.37,45.72 39.37,40.64 v39.37,31.75 | v40.64,12.7 40.64,13.97 40.99,14.32 IC2.16
  Bottom 0.305: v39.37,31.75 39.37,25.4 45.72,19.05 45.72,17.78 45.72,15.24 43.18,12.7 v40.64,12.7
Z-DIR
  Top 0.305: P3.DIR 60.96,29.21 60.96,26.67 59.01,24.72 IC2.46
Z-MOT-1A
  Top 0.305: P3.1A 63.5,52.07 68.58,52.07 SV3.3 71.12,52.07 73.66,52.07 SV3.7
Z-MOT-1B
  Bottom 0.305: P3.1B 63.5,52.07 66.04,54.61 68.58,54.61 SV3.4 71.12,57.15 73.66,57.15 SV3.8
Z-MOT-2A
  Top 0.305: P3.2A 62.23,53.34 SV3.1 68.58,54.61 71.12,54.61 SV3.5
Z-MOT-2B
  Top 0.305: P3.2B 62.23,55.88 SV3.2 68.58,57.15 71.12,57.15 SV3.6
Z-MS1
  Top 0.305: JP15.1 60.96,40.64 | 60.96,40.64 54.61,40.64 53.34,39.37 P3.MS1 | R4.1 60.49,41.11 60.96,40.64
Z-MS2
  Top 0.305: JP16.1 64.14,38.73 56.52,38.73 55.88,38.1 P3.MS2
Z-MS3
  Top 0.305: JP17.1 66.04,38.1 59.69,38.1 P3.MS3
Z-RESETSLEEP
  Top 0.305: P3.!RST P3.!SLP
Z-STEP
  Top 0.305: P3.STEP 59.69,30.48 59.69,26.67 58.54,25.52 IC2.47
Z-STOP  (via drill 0.3)
  Top 0.305: IC2.17 43.53,14.32 v46.99,17.78
  Bottom 0.305: v46.99,17.78 46.99,19.05 49.53,21.59 49.53,38.1 50.8,39.37 54.61,43.18 59.69,43.18 60.96,44.45 63.5,46.99 66.04,46.99 67.31,48.26 67.31,50.8 68.58,52.07 76.2,52.07 SV3.9

### Text on the board
tPlace: v1b 2016
tNames: based on Teensylu | by Laura Eckardt
_tsilk: X-MOTOR | 12V PWR | Y-MOTOR | 12V PWR | Z-MOTOR | 12V PWR | E-MOTOR | 2B | 2A | 1A | 1B | GND | +12V | 2B | 2A | 1A | 1B | GND | +12V | 2B | 2A | 1A | 1B | GND | +12V | 2B | 2A | 1A | 1B | FAN | C5 | Q3 | Extruder | C1 | C2 | C3 | C4 | +12V | Therm. | MS1 | MS2 | MS3 | MS1 | MS2 | MS3 | MS1 | MS2 | MS3 | MS1 | MS2 | MS3 | R3 | R4 | R5 | R2 | LM7805 | Hot End | R14 | X-Axis | Y-Axis | Z-Axis | Extruder | -V | R21 | R16 | - | + | C6 | C10 | R9 | R13 | R1 | ATX+4 | +12V | C13 | C16 | ALE | R19 | R6 | R17 | POWER LED | Q1 | 12V | R20 | R11 | 12V | GND | Bed | C12 | R15 | C7 | -V | R10 | GND | R18 | SCREW | +12V | C9 | R7 | RESET | C11 | Q2 | R12 | Therm. | Hot Bed | R8 | Endstop Voltage | S1 | 12V | 5V | C14 | Teensylu | ver 0.9 | reprap.org/wiki/Teensylu | E-STOP | GND | +V | SIG | X-STOP | GND | +V | SIG | Y-STOP | GND | +V | SIG | Z-STOP | GND | +V | SIG | 12V | 5V | D12 | PWM | D11 | TX1 | D10 | RX1 | D17 | SDA | D16 | SCL | !RESET | SCK | MISO | ISP/SPI | GND | GND | A4 | A3 | A2 | A1 | A0 | GND | MOSI | 5V